# EAGLE schematic m68k_free_run (EAGLE 9.2.2)
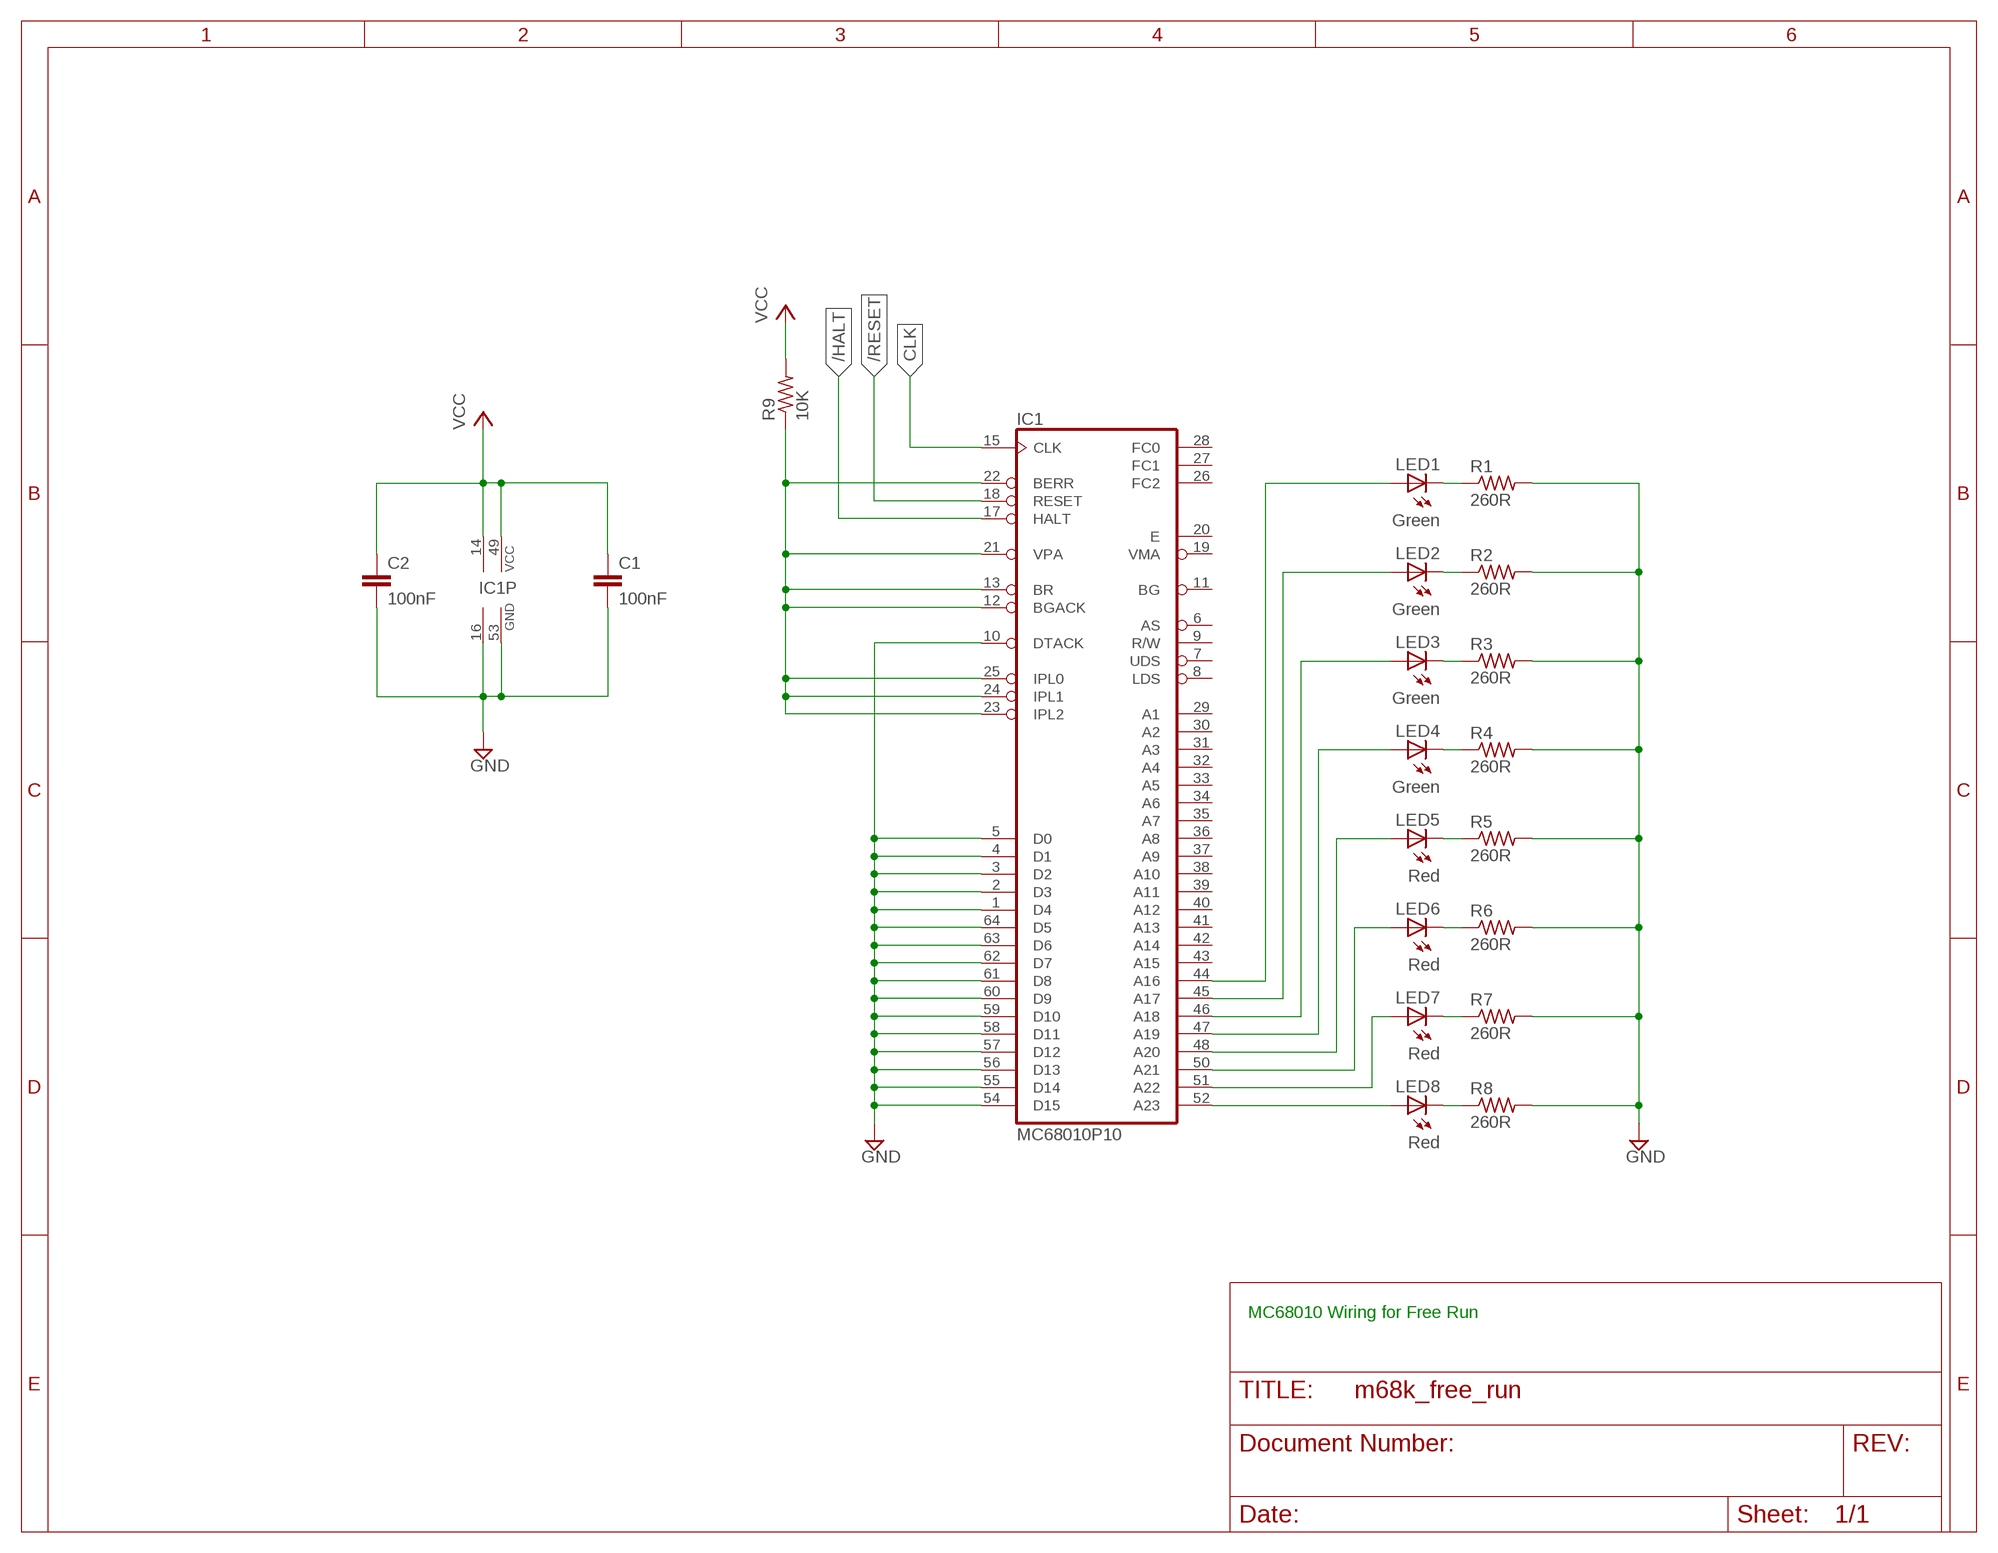
[diagram p0: schematic, sheet 1]

## Parts
C1  100nF  C-EU025-024X044  [C025-024X044]
C2  100nF  C-EU025-024X044  [C025-024X044]
IC1  MC68010P10  MC68000P  [DIL64]
LED1  Green  LED5MM  [LED5MM]
LED2  Green  LED5MM  [LED5MM]
LED3  Green  LED5MM  [LED5MM]
LED4  Green  LED5MM  [LED5MM]
LED5  Red  LED5MM  [LED5MM]
LED6  Red  LED5MM  [LED5MM]
LED7  Red  LED5MM  [LED5MM]
LED8  Red  LED5MM  [LED5MM]
R1  260R  R-US_0207/10  [0207/10]
R2  260R  R-US_0207/10  [0207/10]
R3  260R  R-US_0207/10  [0207/10]
R4  260R  R-US_0207/10  [0207/10]
R5  260R  R-US_0207/10  [0207/10]
R6  260R  R-US_0207/10  [0207/10]
R7  260R  R-US_0207/10  [0207/10]
R8  260R  R-US_0207/10  [0207/10]
R9  10K  R-US_0207/10  [0207/10]

## Nets
/HALT: IC1.17(HALT)
/RESET: IC1.18(RESET)
CLK: IC1.15(CLK)
GND: C1.2 C2.2 IC1.1(D4) IC1.2(D3) IC1.3(D2) IC1.4(D1) IC1.5(D0) IC1.10(DTACK) IC1.16(GND) IC1.53(GND) IC1.54(D15) IC1.55(D14) IC1.56(D13) IC1.57(D12) IC1.58(D11) IC1.59(D10) IC1.60(D9) IC1.61(D8) IC1.62(D7) IC1.63(D6) IC1.64(D5) R1.2 R2.2 R3.2 R4.2 R5.2 R6.2 R7.2 R8.2
N$1: IC1.52(A23) LED8.A
N$2: IC1.51(A22) LED7.A
N$3: IC1.50(A21) LED6.A
N$4: IC1.48(A20) LED5.A
N$5: IC1.47(A19) LED4.A
N$6: IC1.46(A18) LED3.A
N$7: IC1.45(A17) LED2.A
N$8: IC1.44(A16) LED1.A
N$9: LED1.K(C) R1.1
N$10: LED2.K(C) R2.1
N$11: LED3.K(C) R3.1
N$12: LED4.K(C) R4.1
N$13: LED5.K(C) R5.1
N$14: LED6.K(C) R6.1
N$15: LED7.K(C) R7.1
N$16: LED8.K(C) R8.1
N$17: IC1.12(BGACK) IC1.13(BR) IC1.21(VPA) IC1.22(BERR) IC1.23(IPL2) IC1.24(IPL1) IC1.25(IPL0) R9.1
VCC: C1.1 C2.1 IC1.14(VCC) IC1.49(VCC) R9.2
Unconnected: IC1.6(AS) IC1.7(UDS) IC1.8(LDS) IC1.9(R/W) IC1.11(BG) IC1.19(VMA) IC1.20(E) IC1.26(FC2) IC1.27(FC1) IC1.28(FC0) IC1.29(A1) IC1.30(A2) IC1.31(A3) IC1.32(A4) IC1.33(A5) IC1.34(A6) IC1.35(A7) IC1.36(A8) IC1.37(A9) IC1.38(A10) IC1.39(A11) IC1.40(A12) IC1.41(A13) IC1.42(A14) IC1.43(A15)

## Notes on the sheet
- MC68010 Wiring for Free Run

## Library data of the parts
C1 C2 = rcl:C-EU: CAPACITOR, European symbol; SPICEPREFIX: C
IC1 = micro-mc68000:MC68000P: 68xxx PROCESSOR; OC_FARNELL: unknown; OC_NEWARK: unknown
LED1-LED8 = led:LED: LED OSRAM: - CHIPLED LG R971, LG N971, LY N971, LG Q971, LY Q971, LO R971, LY R971 LH N974, LH R974 LS Q976, LO Q976, LY Q976 LO Q996 - Hyper CHIPLED LW Q18S LB Q993, LB Q99A, LB R99A - SideLED LS A670, LO A670, LY A670, LG A670, LP A670 LB A673, LV A673, LT A673, LW A673 LH A674 LY A675 LS A676, LA A676, LO A676, LY A676, LW A676 LS A679, LY A679, LG A679 - Hyper Micro SIDELED® LS Y876, LA Y876, LO Y876, LY Y876 LT Y87S - SmartLED LW L88C, LW L88S LB L89C, LB L89S, LG L890 LS L89K, LO L89K, LY L89K LS L896, LA L896, LO L896, LY L896 - TOPLED LS T670, LO T670, LY T670, LG T670, LP T670 LSG T670, LSP T670, LSY T670, LOP T670, LYG T670 LG T671, LOG T671, LSG T671 LB T673, LV T673, LT T673, LW T673 LH T674 LS T676, LA T676, LO T676, LY T676, LB T676, LH T676, LSB T676, LW T676 LB T67C, LV T67C, LT T67C, LS T67K, LO T67K, LY T67K, LW E67C LS E67B, LA E67B, LO E67B, LY E67B, LB E67C, LV E67C, LT E67C LW T67C LS T679, LY T679, LG T679 LS T770, LO T770, LY T770, LG T770, LP T770 LB T773, LV T773, LT T773, LW T773 LH T774 LS E675, LA E675, LY E675, LS T675 LS T776, LA T776, LO T776, LY T776, LB T776 LHGB T686 LT T68C, LB T68C - Hyper Mini TOPLED® LB M676 - Mini TOPLED Santana® LG M470 LS M47K, LO M47K, LY M47K Source: http://www.osram.convergy.de LUXEON: - LUMILED® LXK2-PW12-R00, LXK2-PW12-S00, LXK2-PW14-U00, LXK2-PW14-V00 LXK2-PM12-R00, LXK2-PM12-S00, LXK2-PM14-U00 LXK2-PE12-Q00, LXK2-PE12-R00, LXK2-PE12-S00, LXK2-PE14-T00, LXK2-PE14-U00 LXK2-PB12-K00, LXK2-PB12-L00, LXK2-PB12-M00, LXK2-PB14-N00, LXK2-PB14-P00, LXK2-PB14-Q00 LXK2-PR12-L00, LXK2-PR12-M00, LXK2-PR14-Q00, LXK2-PR14-R00 LXK2-PD12-Q00, LXK2-PD12-R00, LXK2-PD12-S00 LXK2-PH12-R00, LXK2-PH12-S00 LXK2-PL12-P00, LXK2-PL12-Q00, LXK2-PL12-R00 Source: www.luxeon.com KINGBRIGHT: KA-3528ASYC Source: www.kingbright.com
R1-R9 = rcl:R-US_: RESISTOR, American symbol; SPICEPREFIX: R